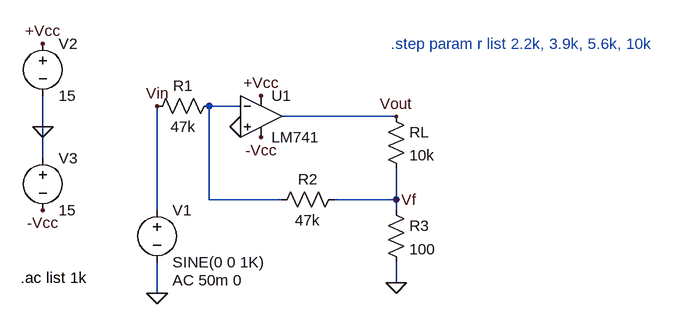
[diagram p0: schematic Lab4.asc]
Lab4.asc, the LTspice schematic file:
Version 4
SHEET 1 880 680
WIRE 176 128 128 128
WIRE 416 144 240 144
WIRE -128 160 -128 112
WIRE -128 208 -128 160
WIRE 128 272 128 128
WIRE 240 272 128 272
WIRE 416 272 416 224
WIRE 416 272 320 272
WIRE 48 288 48 128
WIRE 416 288 416 272
WIRE 416 400 416 368
WIRE 48 416 48 368
FLAG 48 416 0
FLAG -128 160 0
FLAG -128 288 -Vcc
FLAG -128 32 +Vcc
FLAG 208 112 +Vcc
FLAG 208 176 -Vcc
FLAG 416 400 0
FLAG 416 144 Vout
FLAG 48 128 Vin
FLAG 416 272 Vf
FLAG 176 160 0
SYMBOL OpAmps\\LM741 208 80 R0
SYMATTR InstName U1
SYMBOL voltage 48 272 R0
WINDOW 123 24 124 Left 2
WINDOW 39 0 0 Left 0
SYMATTR InstName V1
SYMATTR Value SINE(0 0 1K)
SYMATTR Value2 AC 50m 0
SYMBOL voltage -128 16 R0
WINDOW 123 0 0 Left 0
WINDOW 39 0 0 Left 0
SYMATTR InstName V2
SYMATTR Value 15
SYMBOL voltage -128 192 R0
WINDOW 123 0 0 Left 0
WINDOW 39 0 0 Left 0
SYMATTR InstName V3
SYMATTR Value 15
SYMBOL res 400 128 R0
SYMATTR InstName RL
SYMATTR Value 10k
SYMBOL res 400 272 R0
SYMATTR InstName R3
SYMATTR Value 100
SYMBOL res 144 112 R90
WINDOW 0 0 56 VBottom 2
WINDOW 3 32 56 VTop 2
SYMATTR InstName R1
SYMATTR Value 47k
SYMBOL res 336 256 R90
WINDOW 0 0 56 VBottom 2
WINDOW 3 32 56 VTop 2
SYMATTR InstName R2
SYMATTR Value 47k
TEXT 408 32 Left 2 ;.step param r list 2.2k, 3.9k, 5.6k, 10k
TEXT -162 392 Left 2 !.ac list 1k

The netlist it stands for:
* Lab4.asc
XU1 0 N001 +Vcc -Vcc Vout LM741  ; pins In+ In- V+ V- OUT
V1 Vin 0 SINE(0 0 1K) AC 50m 0
V2 +Vcc 0 15
V3 0 -Vcc 15
RL Vout Vf 10k
R3 Vf 0 100
R1 N001 Vin 47k
R2 Vf N001 47k
* .step param r list 2.2k, 3.9k, 5.6k, 10k
.ac list 1k
.lib LM741.lib
.backanno
.end